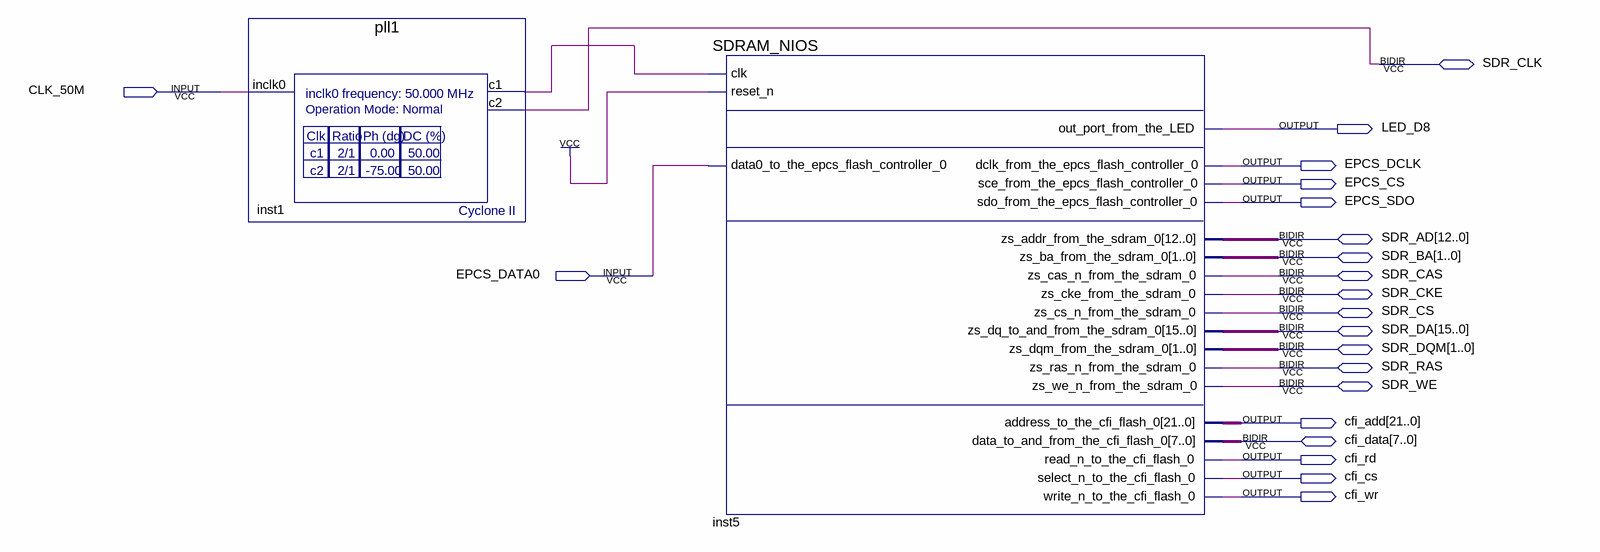
[diagram p0: schematic sheet]
// Quartus schematic NIOS_SDRAM.bdf as structural Verilog: 2 symbols, 21 pins
module NIOS_SDRAM (
  input  CLK_50M,
  input  EPCS_DATA0,
  inout  SDR_CLK,
  inout  [12:0] SDR_AD,
  inout  [1:0] SDR_BA,
  inout  SDR_CAS,
  inout  SDR_CKE,
  inout  SDR_CS,
  inout  [15:0] SDR_DA,
  inout  [1:0] SDR_DQM,
  inout  SDR_RAS,
  inout  SDR_WE,
  inout  [7:0] cfi_data,
  output LED_D8,
  output EPCS_DCLK,
  output EPCS_CS,
  output EPCS_SDO,
  output [21:0] cfi_add,
  output cfi_rd,
  output cfi_cs,
  output cfi_wr
);

  wire inst1_c1;

  pll1 inst1 (.inclk0(CLK_50M), .c1(inst1_c1), .c2(SDR_CLK));
  SDRAM_NIOS inst5 (
    .clk(inst1_c1), .reset_n(1'b1), .data0_to_the_epcs_flash_controller_0(EPCS_DATA0),
    .out_port_from_the_LED(LED_D8), .dclk_from_the_epcs_flash_controller_0(EPCS_DCLK),
    .sce_from_the_epcs_flash_controller_0(EPCS_CS), .sdo_from_the_epcs_flash_controller_0(EPCS_SDO),
    .zs_addr_from_the_sdram_0(SDR_AD), .zs_ba_from_the_sdram_0(SDR_BA), .zs_cas_n_from_the_sdram_0(SDR_CAS),
    .zs_cke_from_the_sdram_0(SDR_CKE), .zs_cs_n_from_the_sdram_0(SDR_CS), .zs_dqm_from_the_sdram_0(SDR_DQM),
    .zs_ras_n_from_the_sdram_0(SDR_RAS), .zs_we_n_from_the_sdram_0(SDR_WE),
    .address_to_the_cfi_flash_0(cfi_add), .read_n_to_the_cfi_flash_0(cfi_rd),
    .select_n_to_the_cfi_flash_0(cfi_cs), .write_n_to_the_cfi_flash_0(cfi_wr),
    .zs_dq_to_and_from_the_sdram_0(SDR_DA), .data_to_and_from_the_cfi_flash_0(cfi_data));
endmodule
